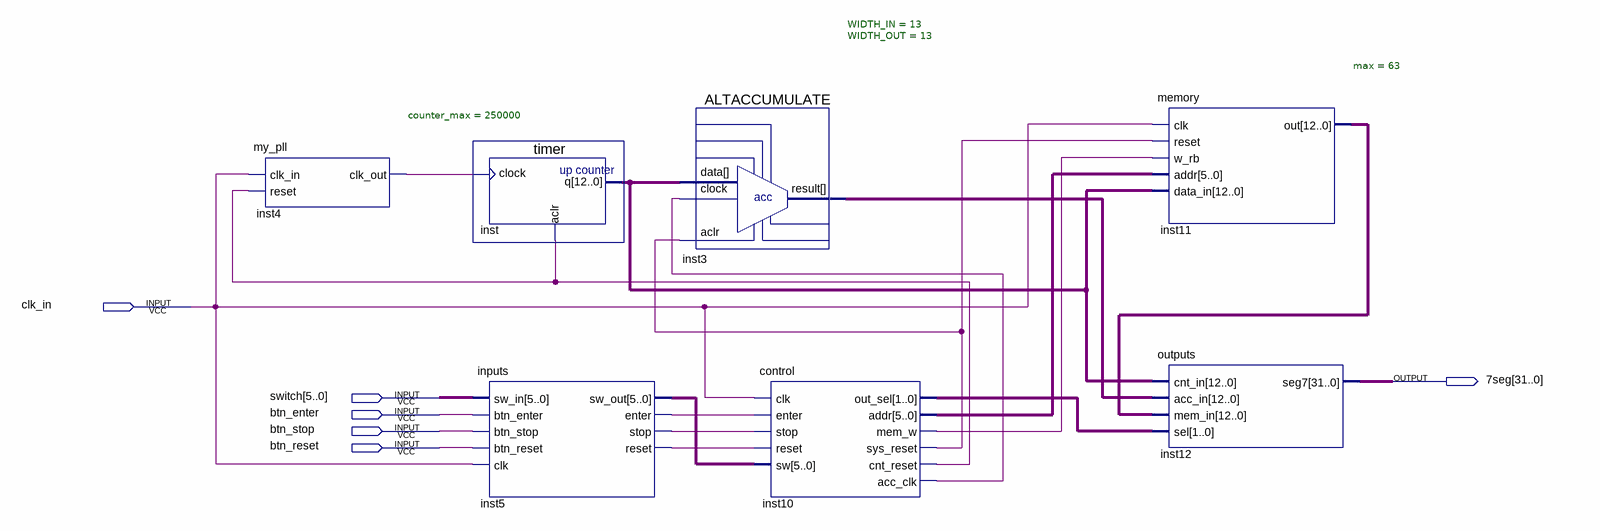
[diagram p0: schematic sheet]
// Quartus schematic lab1.bdf as structural Verilog: 7 symbols, 6 pins
module lab1 (
  input  clk_in,
  input  [5:0] switch,
  input  btn_enter,
  input  btn_stop,
  input  btn_reset,
  output [31:0] \7seg 
);

  wire inst4_clk_out, inst5_enter, inst5_reset, inst5_stop, inst10_acc_clk, inst10_cnt_reset, inst10_mem_w,
       inst10_sys_reset;
  wire [1:0] inst10_out_sel;
  wire [5:0] inst5_sw_out, inst10_addr;
  wire [12:0] inst3_result, inst11_out, inst_q;

  my_pll #(.counter_max(250000)) inst4 (.clk_in(clk_in), .reset(inst10_cnt_reset), .clk_out(inst4_clk_out));
  timer inst (.clock(inst4_clk_out), .aclr(inst10_cnt_reset), .q(inst_q));
  inputs inst5 (
    .sw_in(switch), .btn_enter(btn_enter), .btn_stop(btn_stop), .btn_reset(btn_reset), .clk(clk_in),
    .sw_out(inst5_sw_out), .enter(inst5_enter), .stop(inst5_stop), .reset(inst5_reset));
  ALTACCUMULATE #(.WIDTH_IN(13), .WIDTH_OUT(13)) inst3 (
    .aclr(inst10_sys_reset), .clock(inst10_acc_clk), .data(inst_q), .result(inst3_result));
  control inst10 (
    .clk(clk_in), .enter(inst5_enter), .stop(inst5_stop), .reset(inst5_reset), .sw(inst5_sw_out),
    .out_sel(inst10_out_sel), .addr(inst10_addr), .mem_w(inst10_mem_w), .sys_reset(inst10_sys_reset),
    .cnt_reset(inst10_cnt_reset), .acc_clk(inst10_acc_clk));
  memory #(.max(63)) inst11 (
    .clk(clk_in), .reset(inst10_sys_reset), .w_rb(inst10_mem_w), .addr(inst10_addr), .data_in(inst_q),
    .out(inst11_out));
  outputs inst12 (.cnt_in(inst_q), .acc_in(inst3_result), .mem_in(inst11_out), .sel(inst10_out_sel), .seg7(\7seg ));
endmodule
